# Altium project USBtoUART_FTDI.PrjPcb
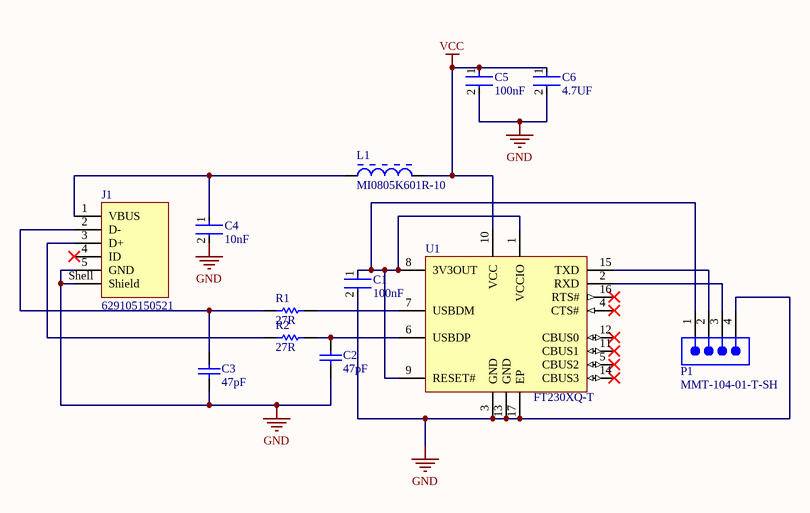
[diagram p0: schematicDoc.SchDoc]
1 sheet, 12 parts. Net scope: global (net labels, ports and power ports of the same name join across sheets).
Board file: ftdi_pcb.PcbDoc

## Sheet schematicDoc.SchDoc
size A4; SheetNumber: 1; SheetTotal: 1

### Parts
C1  100nF  [FP-GRT31C-0_2-IPC_B]
C2  47pF  [CAPC1608X87X35NL15T15]
C3  47pF  [CAPC1608X87X35NL15T15]
C4  10nF  [FP-C0402-BB-MFG]
C5  100nF  [FP-GRT31C-0_2-IPC_B]
C6  4.7UF  [FP-CL21-IPC_A]
J1  629105150521  [629105150521]
L1  MI0805K601R-10  [LIRD-MI0805K601R-10-2_V]
P1  MMT-104-01-T-SH  [SMTC-MMT-104-01-X-SH]
R1  27R  [RESC1005X40X25NL05T10]
R2  27R  [RESC1005X40X25NL05T10]
U1  FT230XQ-T  [QFN-16_M]

### Nets
GND: C1.2 C2.1 C3.1 C4.2 C5.2 C6.2 J1.5(GND) J1.Shell(Shield) P1.4 U1.3(GND) U1.13(GND) U1.17(EP)
VCC: C5.1 C6.1 L1.2 U1.10(VCC)
NetC1_1: C1.1 P1.1 U1.1(VCCIO) U1.8(3V3OUT) U1.9(RESET#)
NetC2_2: C2.2 R2.2 U1.6(USBDP)
NetC3_2: C3.2 J1.2(D-) R1.1
NetC4_1: C4.1 J1.1(VBUS) L1.1
NetJ1_3: J1.3(D+) R2.1
NetP1_2: P1.2 U1.15(TXD)
NetP1_3: P1.3 U1.2(RXD)
NetR1_2: R1.2 U1.7(USBDM)

Not connected (* = marked no-connect by the designer): J1 4(ID)*; U1 4(CTS#)* 5(CBUS2)* 11(CBUS1)* 12(CBUS0)* 14(CBUS3)* 16(RTS#)*

### Library data of the parts
C1 C5 = CMP-06035-026891-1: Multi-Layer Ceramic Capacitor 100nF 25V C0G ±1% 1206 Emboss T/R
C2 C3 = CMP-2006-03500-1: CAP CER 47PF 50V C0G/NP0 0603; Part Number: C0603X470J5GACTU; Manufacturer: Kemet
C4 = CMP-03020-004015-1: C0402 10 nF X7R 10.00% 16 V; Manufacturer: Kemet; Manufacturer Part Number: C0402C103K4RAC; Capacitance: 10,000 pF; Voltage Rating: 16 V; Tolerance: 0.1; Temperature Coefficient: 15%; Material: Ceramic; Value: 10,000 pF; Ipc Land Pattern Name: CAPC10050X50; Automotive: No; Device Class L2: Capacitors; Category: Cap; Package: C0402-BB; Lead Free: Yes; Temperature: -55°C to +125°C; ComponentLink2URL: https://content.kemet.com/datasheets/KEM_C1002_X7R_SMD.pdf; Temperature Range Low: -55°C; Octopart: https://octopart.com/c0402c103k4rac-kemet-1325399; Temperature Characteristic: X7R; ComponentLink2Description: Datasheet; Device Class L1: Passive Components; RoHS: TRUE; Mouser Description: Multilayer Ceramic Capacitors MLCC - SMD/SMT 16volts 0.01uF 10% X7R; Temperature Range High: +125°C; Device Class L3: Ceramic Capacitors; Height: 0.55mm
C6 = CMP-13271-002852-1: CL21 Series 0805 4.7uF 16V ±10% Tolerance X7R Multilayer Ceramic Chip Capacitor; Ratings: AEC-Q200; Features: Soft Termination; Length: 0.079inch; Min Operating Temperature: -55°C; Tolerance: 10%; Case Code (Imperial): 0805; Mount: Surface Mount; Width: 0.049inch; Case/Package: 0805; Voltage Rating: 16V; Case Code (Metric): 2012; Thickness: 0.037inch; Capacitance: 4.7uF; Packaging: Tape and Reel; Max Operating Temperature: 125°C
J1 = CMP-1502-03252-4: USB Connector, 5 Contact(s), Female, Right Angle, Surface Mount Terminal, Locking; Operating Supply Voltage: 30V; USB Standard: USB 2.0; Insulation Resistance: 1GΩ; Contact Resistance: 30mΩ; Current Rating: 3A; Gender: Receptacle; Number of Contacts: 5; Height: 2.86mm; Connector Type: USB; Min Operating Temperature: -40°C; Max Operating Temperature: 85°C; Number of Pins: 5; Contact Material: Gold; Features: Shielded; Voltage Rating: 30V; RoHS: Compliant; Termination: SMD/SMT; Orientation: Horizontal; REACH SVHC: Unknown; Contact Plating: Gold; Mount: Horizontal, Surface Mount; Packaging: Tape and Reel; Lead Free: Lead Free
L1 = CMP-2000-05196-1: Chip Bead for Power Filtering, 1500 mA, 600 Ohm, -40 to 125 degC, 0805 (2012 Metric), RoHS, Tape and Reel; Manufacturer: Laird; Filter Type: PowerLine; Current Rating (Max): 1.5A; Catalog Drawings: (HI,HZ,LI,MI)0805Series_1.10mmMax.Height; Impedance @ Frequency: 600Ohm@100MHz; Number of Lines: 1; DC Resistance (DCR) (Max): 100mOhm; Other Names: 240-2390-1; Kits: 240-2227-ND-KITEMIFERRITEBEADCHIPSMD; Online Catalog: MISeries; Standard Package: 1; Datasheet Version: Rev. A, 01/2004; Height (Max): 0.043"(1.10mm); Category: Filters; Operating Temperature: -40degC~125degC; Package Description: 2-Pin Surface Mount Device, Body 2 x 1.25 mm; Package / Case: 0805(2012Metric); Package Reference: MI0805K601R-10-2; Packaging: CutTape(CT); Ratings: -; Mounting Type: SurfaceMount; Datasheet URL: https://datasheet.ciiva.com/3082/mi0805k601r-10-a-vp-3082219.pdf; Size / Dimension: 0.079"Lx0.049"W(2.00mmx1.25mm); Family: FerriteBeadsandChips; Manufacturer URL: https://www.lairdtech.com; Series: MI
P1 = CMP-1029-00049-1: Horizontal Surface Mount Header, -55 to 105 degC, 2 mm Pitch, 4-Pin, Male, RoHS; Manufacturer: Samtec; Pitch: 2 mm; Orientation: Horizontal; RoHS: True; Mounting Technology: Surface Mount; PackageReference: MMT-104-01-X-SH; ComponentLink2URL: http://d2a072wq521u33.cloudfront.net/catalog_english//MMT_SM.PDF; Temperature Range: -55 to 105 degC; PartNumber: MMT-104-01-T-SH; ComponentLink1Description: Manufacturer URL; PackageVersion: CY, 12/2000; ComponentLink1URL: http://www.samtec.com; ComponentLink3Description: Package Specification; ComponentLink3URL: http://www.samtec.com/documents/webfiles/cpdf/MMT-1XX-XX-XX-XX-XX-XXX-X-XX-MKT.pdf; PackageDescription: 2mm Horizontal Terminal Surface Mount Strip ASSEM; DatasheetVersion: F-214; ComponentLink2Description: Datasheet
R1 R2 = CMP-2002-08077-1: 27 Ohms ±5% 0.063W, 1/16W Chip Resistor 0402 (1005 Metric) Moisture Resistant Thick Film; Manufacturer: Yageo; Part Number: RC0402JR-1327RL
U1 = CMP-0248-00009-2: USB to Basic UART Interface Chip, UHCI/OHCI/EHCI Compatible, USB 2.0 Compatible, -40 to +85 degC, 16-Pin QFN, Pb-Free, Tray; Manufacturer: FTDI; ComponentLink2Description: Datasheet; ComponentLink1Description: Manufacturer URL; ComponentLink3URL: www.ftdichip.com/Products/ICs/FT230X.html; ComponentLink1URL: http://www.ftdichip.com/; DatasheetVersion: ver 1.2, Feb-2013; Code_JEDEC: MO-220WGGC; ComponentLink2URL: http://www.ftdichip.com/Support/Documents/DataSheets/ICs/DS_FT230X.pdf; PackageVersion: Feb-13; PackageReference: QFN-16; PackageDescription: 16-Pin Quad Flat No-Lead, 4x4 mm Body, 0.65 mm Pitch; PartNumber: FT230XQ-T; RevisionNote: DatasheetVersion updated to 1.2 Feb-2013; ComponentLink3Description: FT230X Product Page